# Altium project PCB_Project1.PrjPCB
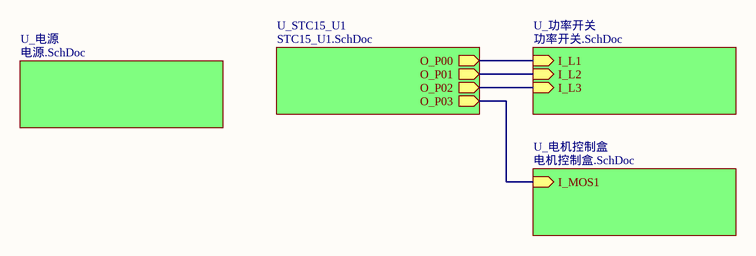
[diagram p0: 主结构图.SchDoc]
5 sheets, 93 parts. Net scope: hierarchical (ports join the sheet entries above them; power ports are global).
Board file: PCB1规则OK_铺铜.PcbDoc
Sheets:
  主结构图.SchDoc
    U_电源 = 电源.SchDoc
    U_STC15_U1 = STC15_U1.SchDoc
    U_电机控制盒 = 电机控制盒.SchDoc
    U_功率开关 = 功率开关.SchDoc

## Sheet 主结构图.SchDoc
size A4; DocumentNumber: 1; SheetNumber: 1; SheetTotal: 3

### Sub-sheets
U_STC15_U1 = STC15_U1.SchDoc: O_P00 (out), O_P01 (out), O_P02 (out), O_P03 (out)
U_功率开关 = 功率开关.SchDoc: I_L1 (in), I_L2 (in), I_L3 (in)
U_电机控制盒 = 电机控制盒.SchDoc: I_MOS1 (in)
U_电源 = 电源.SchDoc: no entries

### Nets
P0BUS0: sheet U_STC15_U1/O_P00, sheet U_功率开关/I_L1
P0BUS1: sheet U_STC15_U1/O_P01, sheet U_功率开关/I_L2
P0BUS2: sheet U_STC15_U1/O_P02, sheet U_功率开关/I_L3
P0BUS3: sheet U_STC15_U1/O_P03, sheet U_电机控制盒/I_MOS1

## Sheet 电源.SchDoc
size A4; DocumentNumber: 2; SheetNumber: 3; SheetTotal: 3
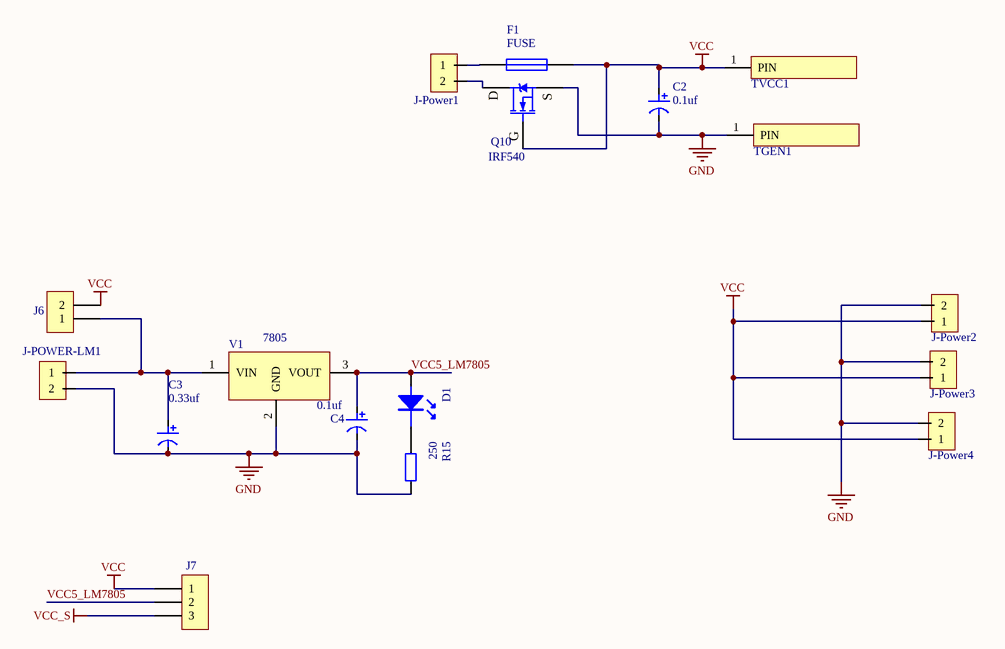
[diagram p1: 电源.SchDoc]

### Parts
C2  0.1uf  [CE5-6R5X5-1mm]
C3  0.33uf  [CE5-6R5X5-1mm]
C4  0.1uf  [CE5-6R5X5-1mm]
D1  333-2SYGD/S530-E2  [LED2-D5R9X8R7]  (value not drawn)
F1  FUSE  [FUSE-24R1X3RX29R7-TH]
J6  PAS1251-0201A01B1BA  [CON2P-2R54-TH]  (value not drawn)
J7  PAS1251-0301A01B1BA  [CON3P-2R54-TH]  (value not drawn)
J-Power1  KF301-5.08-2p  [KF301-5.0-2P]  (value not drawn)
J-Power2  KF301-5.08-2p  [KF301-5.0-2P]  (value not drawn)
J-Power3  KF301-5.08-2p  [KF301-5.0-2P]  (value not drawn)
J-Power4  KF301-5.08-2p  [KF301-5.0-2P]  (value not drawn)
J-POWER-LM1  KF301-5.08-2p  [KF301-5.0-2P]  (value not drawn)
Q10  IRF540  [TO220A]
R15  250  [RY0R25W]
TGEN1  T？  [铺铜条]  (value not drawn)
TVCC1  T？  [铺铜条]  (value not drawn)
V1  7805  [TO220A]

### Nets
GND: C2.2 C3.2 C4.2 J-Power2.2 J-Power3.2 J-Power4.2 J-POWER-LM1.2 Q10.3(S) R15.2 TGEN1.1(PIN) V1.2(GND)
VCC: C2.1 F1.2 J6.2 J7.1 J-Power2.1 J-Power3.1 J-Power4.1 Q10.1(G) TVCC1.1(PIN)
VCC_S: J7.3
VCC5_LM7805: C4.1 D1.1 J7.2 V1.3(VOUT)
NetC3_1: C3.1 J6.1 J-POWER-LM1.1 V1.1(VIN)
NetD1_2: D1.2 R15.1
NetF1_1: F1.1 J-Power1.1
NetJ-Power1_2: J-Power1.2 Q10.2(D)

### Library data of the parts
C2-C4 = 102CB-00002OD.01: DIP,电容量681pf,额定电压2000V,偏差±10%,6.5X5mm; Allow Altenative Part: Y; serial number: 14; Categories: 电容; Value: 681pF; Tolerance: ±10%; Rated Voltage: 2000V; COMPONENTLINK 1 DESCRIPTION: ShowDatasheet; Remark: Verified by BU1（黄雄青） check list V1.0; Modify time: 2015年11月05号; Approved: YES; Part Number: 102CB-00002OD.01; Category: 陶瓷电容; Operating Temperature: -25°C~105°C; PACKAGE: Bulk; Mounting Type: ThroughHole; Applications: Automotive; Size: 6.5; Max Thickness: 5; Supplier 1: TDK; Supplier Part Number 1: CK45-B3DD681KYLR; Pricing 1: 0.7242; COMPONENTLINK 1 URL: http://pdf-file.ic37.com/pdf6/TDK/CK45-B3DD222KYNA_datasheet_1118532/182787/CK45-B_datasheet.pdf; MOQ: 1000
D1 = 102DL-00010CH.01: DIP,封装/间距直径5/2.54mm,额定电压2V,亮度普亮,绿色; Allow Altenative Part: Y; serial number: 4; Categories: 二极管; Rated Voltage: 2V; COMPONENTLINK 1 DESCRIPTION: GetDatasheet; Remark: Verified by CRD（张宗良） check list V1.0; Modify time: 2015年11月11号; Approved: YES; Part Number: 102DL-00010CH.01; Category: 发光二极管; Value: 333-2SYGD/S530-E2; Other: 绿色; PACKAGE: Bulk; Mounting Type: ThroughHole; Supplier 1: 台湾亿光; Supplier Part Number 1: 333-2SYGD/S530-E2; Pricing 1: .3619; COMPONENTLINK 1 URL: http://www.everlight.com/file/ProductFile/201407052217358844.pdf; MOQ: 4000
F1 = 102FP-00037BI.01: DIP,24.1x29.7x3.0mm,额定电压30V,额定电流9A,触发电流18A,中速断; Allow Altenative Part: Y; serial number: 2; Categories: 保险丝; Value: R30-900; Rated Voltage: 30V; Rated Current: 9A; COMPONENTLINK 1 DESCRIPTION: GetDatasheet; Remark: Verified by BU1（黄雄青） check list V1.0; Modify time: 2015年07月10号; Approved: YES; Part Number: 102FP-00037BI.01; Category: 自恢复保险丝; PACKAGE: Bulk; Mounting Type: ThroughHole; Supplier 1: SEA&LAND; Supplier Part Number 1: R30-900; Pricing 1: .4; COMPONENTLINK 1 URL: http://www.littelfuse.name/te_product_d_c914/2013-10-18/7630.chtml; MOQ: 500
J6 = 102NL-00005DJ.01: DIP,封装脚距2.54mm,180度,1x2PIN,上针/下针6.0/3.0mm,黑色; Allow Altenative Part: Y; serial number: 286; Categories: 连接器; COMPONENTLINK 1 DESCRIPTION: GetDatasheet; Remark: Verified by BU2（叶俊雄） check list V1.0; Modify time: 2016年08月22号; Approved: YES; Part Number: 102NL-00005DJ.01; Category: 单排针; Value: PAS1251-0201A01B1BA; PACKAGE: Bulk; Mounting Type: ThroughHole; Supplier 1: 骏佳; Supplier Part Number 1: PAS1251-0201A01B1BA; Pricing 1: .03; COMPONENTLINK 1 URL: http://www.hkjb888.com/product.asp?action=detailed&id=1099&page=3&pid=245; MOQ: 500
J7 = 102NL-00001DJ.01: DIP,封装脚距2.54mm,180度,1x3PIN,黑色; Allow Altenative Part: Y; serial number: 168; Categories: 连接器; COMPONENTLINK 1 DESCRIPTION: GetDatasheet; Remark: Verified by CRD（赖程奇） check list V1.0; Modify time: 2016年1月11号; Approved: YES; Part Number: 102NL-00001DJ.01; Category: 单排针; Value: PAS1251-0301A01B1BA; PACKAGE: Bulk; Mounting Type: ThroughHole; Supplier 1: 骏佳; Supplier Part Number 1: PAS1251-0301A01B1BA; Pricing 1: 2.05; COMPONENTLINK 1 URL: http://www.hkjb888.com/product.asp?page=7; MOQ: 100
J-Power1-J-Power4 J-POWER-LM1 = KF301
Q10 = IRF840: N沟场效应管; 版权归属: 源创客; BOM名称: N沟场效应管; 学习资源: www.ooocke.com
R15 = 102RO-00087BS.01: DIP,阻值500R,精度±0.1%,4.75x1.65mm,额定功率1/4W; Allow Altenative Part: Y; serial number: 14; Categories: 电阻; Value: 500R; Tolerance: ±0.1%; Rated Power: 1/4W; COMPONENTLINK 1 DESCRIPTION: OpenDatasheet; Remark: Verified by BU3（吴明徽）check list V1.0; Modify time: 2015年11月30号; Approved: YES; Part Number: 102RO-00087BS.01; Category: 功率电阻; PACKAGE: Bulk; Mounting Type: ThroughHole; Size: 1.65x4.75mm; Supplier 1: Vishay; Supplier Part Number 1: CMF50500R00BKRE; Pricing 1: 1.29322; COMPONENTLINK 1 URL: http://www.vishay.com/docs/31018/cmfind.pdf; MOQ: 1000
TGEN1 TVCC1 = 铺铜条: 2mm*20的铜条用于焊接
V1 = 78xx: 线性稳压芯片; 版权归属: 源创客; BOM名称: 线性稳压芯片; 学习资源: www.ooocke.com

## Sheet STC15_U1.SchDoc
size A4; DocumentNumber: 3; SheetNumber: 2; SheetTotal: 3
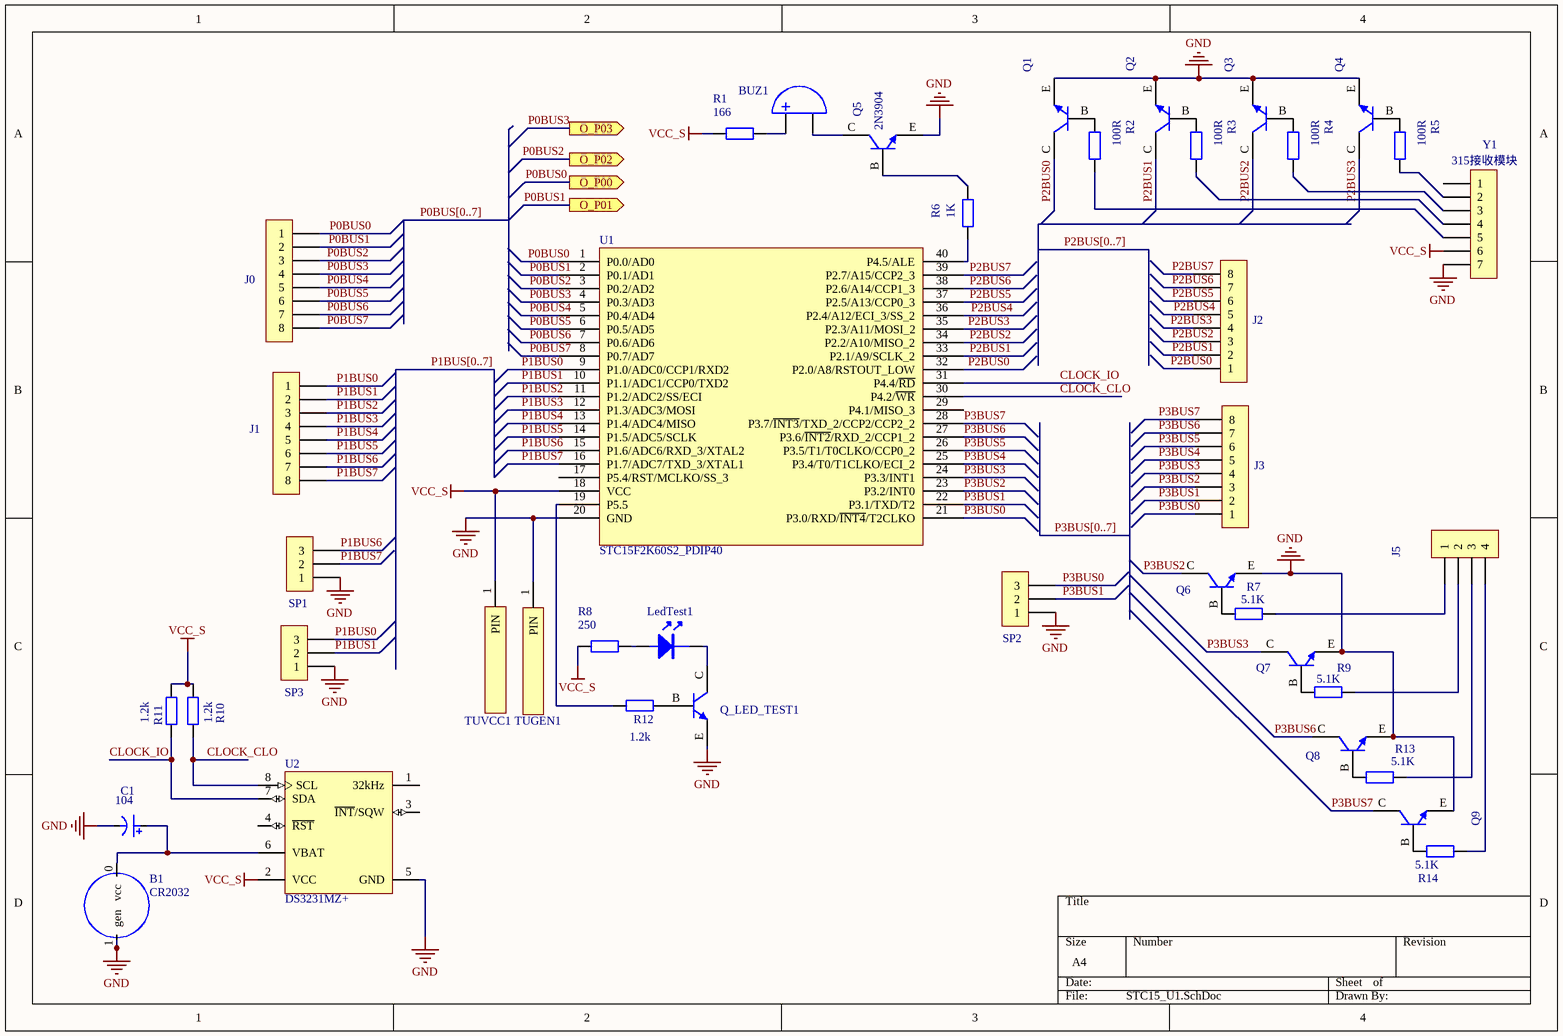
[diagram p2: STC15_U1.SchDoc]

### Parts
B1  CR2032  [CR2032座]
BUZ1  SD1209T5-A1  [BUZ5-12-0R5-9MM]  (value not drawn)
C1  104  [CE5-6R5X5-1mm]
J0  W7810811120AB  [XH8P-2R54-TH]  (value not drawn)
J1  W7810811120AB  [XH8P-2R54-TH]  (value not drawn)
J2  W7810811120AB  [XH8P-2R54-TH]  (value not drawn)
J3  W7810811120AB  [XH8P-2R54-TH]  (value not drawn)
J5  W7810411120AB  [XH4P-2R54-TH]  (value not drawn)
LedTest1  333-2SUBD/S400-A4  [LED2-D5X5]  (value not drawn)
Q1  2N3904  [TO-92-3-EBC]  (value not drawn)
Q2  2N3904  [TO-92-3-EBC]  (value not drawn)
Q3  2N3904  [TO-92-3-EBC]  (value not drawn)
Q4  2N3904  [TO-92-3-EBC]  (value not drawn)
Q5  2N3904  [TO-92-3-EBC]
Q6  2N3904  [TO-92-3-EBC]  (value not drawn)
Q7  2N3904  [TO-92-3-EBC]  (value not drawn)
Q8  2N3904  [TO-92-3-EBC]  (value not drawn)
Q9  2N3904  [TO-92-3-EBC]  (value not drawn)
Q_LED_TEST1  2N3904  [TO-92-3-EBC]  (value not drawn)
R1  166  [RY0R25W]
R2  100R  [RY0R25W]
R3  100R  [RY0R25W]
R4  100R  [RY0R25W]
R5  100R  [RY0R25W]
R6  1K  [RY0R25W]
R7  5.1K  [RY0R25W]
R8  250  [RY0R25W]
R9  5.1K  [RY0R25W]
R10  1.2k  [RY0R25W]
R11  1.2k  [RY0R25W]
R12  1.2k  [RY0R25W]
R13  5.1K  [RY0R25W]
R14  5.1K  [RY0R25W]
SP1  (no value)  [XH3P-2R54-TH]
SP2  (no value)  [XH3P-2R54-TH]
SP3  (no value)  [XH3P-2R54-TH]
TUGEN1  T？  [铺铜条]  (value not drawn)
TUVCC1  T？  [铺铜条]  (value not drawn)
U1  STC15F2K60S2_PDIP40  [DIP40]
U2  DS3231MZ+  [S8MK+1_L]
Y1  315接收模块  [CON7P-2R54-TH]

### Ports
O_P00 (out), O_P01 (out), O_P02 (out), O_P03 (out)

### Nets
GND: B1.1(gen) C1.2 Q1.E Q2.E Q3.E Q4.E Q5.E Q6.E Q7.E Q8.E Q9.E Q_LED_TEST1.E SP1.1 SP2.1 SP3.1 TUGEN1.1(PIN) U1.20(GND) U2.5(GND) Y1.7
VCC_S: R1.1 R8.1 R10.1 R11.1 TUVCC1.1(PIN) U1.18(VCC) U2.2(VCC) Y1.6
CLOCK_CLO: R10.2 U1.30(P4.2/~{WR}) U2.8(SCL)
CLOCK_IO: R11.2 U1.31(P4.4/~{RD}) U2.7(SDA)
P0BUS0: J0.1 U1.1(P0.0/AD0) ; port O_P00
P0BUS1: J0.2 U1.2(P0.1/AD1) ; port O_P01
P0BUS2: J0.3 U1.3(P0.2/AD2) ; port O_P02
P0BUS3: J0.4 U1.4(P0.3/AD3) ; port O_P03
P0BUS4: J0.5 U1.5(P0.4/AD4)
P0BUS5: J0.6 U1.6(P0.5/AD5)
P0BUS6: J0.7 U1.7(P0.6/AD6)
P0BUS7: J0.8 U1.8(P0.7/AD7)
P1BUS0: J1.1 SP3.3 U1.9(P1.0/ADC0/CCP1/RXD2)
P1BUS1: J1.2 SP3.2 U1.10(P1.1/ADC1/CCP0/TXD2)
P1BUS2: J1.3 U1.11(P1.2/ADC2/SS/ECI)
P1BUS3: J1.4 U1.12(P1.3/ADC3/MOSI)
P1BUS4: J1.5 U1.13(P1.4/ADC4/MISO)
P1BUS5: J1.6 U1.14(P1.5/ADC5/SCLK)
P1BUS6: J1.7 SP1.3 U1.15(P1.6/ADC6/RXD_3/XTAL2)
P1BUS7: J1.8 SP1.2 U1.16(P1.7/ADC7/TXD_3/XTAL1)
P2BUS0: J2.1 Q1.C U1.32(P2.0/A8/RSTOUT_LOW)
P2BUS1: J2.2 Q2.C U1.33(P2.1/A9/SCLK_2)
P2BUS2: J2.3 Q3.C U1.34(P2.2/A10/MISO_2)
P2BUS3: J2.4 Q4.C U1.35(P2.3/A11/MOSI_2)
P2BUS4: J2.5 U1.36(P2.4/A12/ECI_3/SS_2)
P2BUS5: J2.6 U1.37(P2.5/A13/CCP0_3)
P2BUS6: J2.7 U1.38(P2.6/A14/CCP1_3)
P2BUS7: J2.8 U1.39(P2.7/A15/CCP2_3)
P3BUS0: J3.1 SP2.3 U1.21(P3.0/RXD/~{INT4}/T2CLKO)
P3BUS1: J3.2 SP2.2 U1.22(P3.1/TXD/T2)
P3BUS2: J3.3 Q6.C U1.23(P3.2/INT0)
P3BUS3: J3.4 Q7.C U1.24(P3.3/INT1)
P3BUS4: J3.5 U1.25(P3.4/T0/T1CLKO/ECI_2)
P3BUS5: J3.6 U1.26(P3.5/T1/T0CLKO/CCP0_2)
P3BUS6: J3.7 Q8.C U1.27(P3.6/~{INT2}/RXD_2/CCP1_2)
P3BUS7: J3.8 Q9.C U1.28(P3.7/~{INT3}/TXD_2/CCP2/CCP2_2)
NetB1_0: B1.0(vcc) C1.1 U2.6(VBAT)
NetBUZ1_1: BUZ1.1 R1.2
NetBUZ1_2: BUZ1.2 Q5.C
NetJ5_1: J5.1 R7.2
NetJ5_2: J5.2 R9.2
NetJ5_3: J5.3 R13.2
NetJ5_4: J5.4 R14.2
NetLedTest1_1: LedTest1.1 R8.2
NetLedTest1_2: LedTest1.2 Q_LED_TEST1.C
NetQ1_B: Q1.B R2.1
NetQ2_B: Q2.B R3.1
NetQ3_B: Q3.B R4.1
NetQ4_B: Q4.B R5.1
NetQ5_B: Q5.B R6.2
NetQ6_B: Q6.B R7.1
NetQ7_B: Q7.B R9.1
NetQ8_B: Q8.B R13.1
NetQ9_B: Q9.B R14.1
NetQ_LED_TEST1_B: Q_LED_TEST1.B R12.2
NetR2_2: R2.2 Y1.5
NetR3_2: R3.2 Y1.4
NetR4_2: R4.2 Y1.3
NetR5_2: R5.2 Y1.2
NetR6_1: R6.1 U1.40(P4.5/ALE)
NetR12_1: R12.1 U1.19(P5.5)

Not connected (* = marked no-connect by the designer): U1 17(P5.4/RST/MCLKO/SS_3) 29(P4.1/MISO_3); U2 1(32kHz) 3(~{INT}/SQW) 4(~{RST}); Y1 1

### Buses and harness runs
bus P0BUS[0..7]
bus P1BUS[0..7]
bus P2BUS[0..7]
bus P3BUS[0..7]

### Library data of the parts
BUZ1 = 102BA-00004OD.01: DIP,12x9mm,额定电压DC5V,频率2048Hz,黑色,间距5mm; Allow Altenative Part: Y; serial number: 4; Categories: 蜂鸣器; COMPONENTLINK 1 DESCRIPTION: GetDatasheet; Remark: Verified by BU1（黄雄青） check list V1.0; Modify time: 2016年05月12号; Approved: YES; Part Number: 102BA-00004OD.01; Category: 有源蜂鸣器; Value: SD1209T5-A1; PACKAGE: tray; Mounting Type: ThroughHole; Size: 12x9mm; Supplier 1: TDK; Supplier Part Number 1: SD1209T5-A1; Pricing 1: 6.73; COMPONENTLINK 1 URL: https://product.tdk.com/info/en/catalog/datasheets/ec211_sd.pdf; MOQ: 5000
C1 = 102CB-00002OD.01: as C2 on sheet 电源; Part Number: 102CB-00002OD.01; Category: 陶瓷电容; Operating Temperature: -25°C~105°C; PACKAGE: Bulk; Mounting Type: ThroughHole; Applications: Automotive; Size: 6.5; Max Thickness: 5; Supplier 1: TDK; Supplier Part Number 1: CK45-B3DD681KYLR; Pricing 1: 0.7242; COMPONENTLINK 1 URL: http://pdf-file.ic37.com/pdf6/TDK/CK45-B3DD222KYNA_datasheet_1118532/182787/CK45-B_datasheet.pdf; MOQ: 1000
J0-J3 = 102NB-00026CY.01: DIP,座子,封装脚距2.54mm,180度,1x8PIN,塑高/针长7.0/3.40mm,白色; Allow Altenative Part: Y; serial number: 280; Categories: 连接器; COMPONENTLINK 1 DESCRIPTION: GetDatasheet; Remark: Verified by CRD（赖程奇） check list V1.0; Modify time: 2016年08月22号; Approved: YES; Part Number: 102NB-00026CY.01; Category: XH连接器; Value: W7810811120AB; PACKAGE: Bulk; Mounting Type: ThroughHole; Supplier 1: 富盈源; Supplier Part Number 1: W7810811120AB; Pricing 1: .03; COMPONENTLINK 1 URL: http://www.fyconn.com/productView.asp?id=445; MOQ: 500
J5 = 102NB-00025CY.01: DIP,座子,封装脚距2.54mm,180度,1x4PIN,塑高/针长7.0/3.40mm,白色; Allow Altenative Part: Y; serial number: 276; Categories: 连接器; COMPONENTLINK 1 DESCRIPTION: GetDatasheet; Remark: Verified by CRD（赖程奇） check list V1.0; Modify time: 2016年05月12号; Approved: YES; Part Number: 102NB-00025CY.01; Category: XH连接器; Value: W7810411120AB; PACKAGE: Bulk; Mounting Type: ThroughHole; Supplier 1: 富盈源; Supplier Part Number 1: W7810411120AB; Pricing 1: 3.8; COMPONENTLINK 1 URL: http://www.fyconn.com/productView.asp?id=340; MOQ: 500
LedTest1 = 102DL-00029CH.01: DIP,封装/间距直径5/2.54mm,额定电压3.3V,亮度高亮,蓝色; Allow Altenative Part: Y; serial number: 36; Categories: 二极管; Rated Voltage: 3.3V; COMPONENTLINK 1 DESCRIPTION: OpenDatasheet; Remark: Verified by CRD（张宗良） check list V1.0; Modify time: 2017年01月07号; Approved: YES; Part Number: 102DL-00029CH.01; Category: 发光二极管; Value: 333-2SUBD/S400-A4; Other: 蓝色; PACKAGE: Bulk; Mounting Type: ThroughHole; Supplier 1: 台湾亿光; Supplier Part Number 1: 333-2SUBD/S400-A4; COMPONENTLINK 1 URL: http://www.everlight.com/file/ProductFile/333-2SUBD-S400-A4.pdf
Q1-Q9 Q_LED_TEST1 = 102GN-00009BA.01: DIP,封装形式TO-92-3,耐压值40V,额定电流200mA,耗散功率625mW; Allow Altenative Part: Y; serial number: 1; Categories: 三极管; Rated Power: 625mW; Rated Voltage: 40V; Rated Current: 0.2A; COMPONENTLINK 1 DESCRIPTION: OpenDatasheet; Remark: Verified by BU1（吴明徽）check list V1.0; Modify time: 2015年08月08号; Approved: YES; Part Number: 102GN-00009BA.01; Category: NPN三极管; Value: 2N3904; PACKAGE: Tape&Reel; Mounting Type: SurfaceMount; Size: TO-92-3; Supplier 1: ON; Supplier Part Number 1: 2N3904; Pricing 1: .17; COMPONENTLINK 1 URL: http://media.digikey.com/pdf/Data%20Sheets/ON%20Semiconductor%20PDFs/2N3903,%202N3904%20Rev4.pdf; MOQ: 1000
R1 = 102RO-00079BW.01: DIP,阻值1K,精度±5%,9.0x3.3mm,额定功率1/2W; Allow Altenative Part: Y; serial number: 13; Categories: 电阻; Value: 1K; Tolerance: ±5%; Rated Power: 1/2W; COMPONENTLINK 1 DESCRIPTION: OpenDatasheet; Remark: Verified by BU3（吴明徽）check list V1.0; Modify time: 2015年07月10号; Approved: YES; Part Number: 102RO-00079BW.01; Category: 功率电阻; PACKAGE: Bulk; Mounting Type: ThroughHole; Size: 9.0x3.3mm; Supplier 1: YAGEO; Supplier Part Number 1: CFR-50JB-52-1K; Pricing 1: .155; COMPONENTLINK 1 URL: http://www.yageo.com/documents/recent/Yageo%20LR_CFR_2013.pdf; MOQ: 500
R2-R5 = 102RO-00040BS.01: DIP,阻值100R,精度±1%,6.1x2.29mm,额定功率1/4W; Allow Altenative Part: Y; serial number: 15; Categories: 电阻; Tolerance: ±1%; Rated Power: 1/4W; COMPONENTLINK 1 DESCRIPTION: OpenDatasheet; Remark: Verified by BU3（吴明徽）check list V1.0; Modify time: 2015年07月10号; Approved: YES; Part Number: 102RO-00040BS.01; Category: 功率电阻; Value: 100R; PACKAGE: Bulk; Mounting Type: ThroughHole; Size: 2.29x7.37mm; Supplier 1: Vishay; Supplier Part Number 1: CMF55100R00FKRE39; Pricing 1: 1.44; COMPONENTLINK 1 URL: http://www.vishay.com/docs/31027/cmfmil.pdf; MOQ: 5000
R6 = 102RO-00079BW.01: DIP,阻值1K,精度±5%,9.0x3.3mm,额定功率1/2W; Allow Altenative Part: Y; serial number: 13; Categories: 电阻; Tolerance: ±5%; Rated Power: 1/2W; COMPONENTLINK 1 DESCRIPTION: OpenDatasheet; Remark: Verified by BU3（吴明徽）check list V1.0; Modify time: 2015年07月10号; Approved: YES; Part Number: 102RO-00079BW.01; Category: 功率电阻; Value: 1K; PACKAGE: Bulk; Mounting Type: ThroughHole; Size: 9.0x3.3mm; Supplier 1: YAGEO; Supplier Part Number 1: CFR-50JB-52-1K; Pricing 1: .155; COMPONENTLINK 1 URL: http://www.yageo.com/documents/recent/Yageo%20LR_CFR_2013.pdf; MOQ: 500
R7 R9 R13 R14 = 102RO-00048BS.01: DIP,阻值5.1K,精度±1%,6.2x2.29mm,额定功率1/4W; Allow Altenative Part: Y; serial number: 10; Categories: 电阻; Tolerance: ±1%; Rated Power: 1/4W; COMPONENTLINK 1 DESCRIPTION: OpenDatasheet; Remark: Verified by BU3（吴明徽）check list V1.0; Modify time: 2015年07月10号; Approved: YES; Part Number: 102RO-00048BS.01; Category: 功率电阻; Value: 5.1K; PACKAGE: Bulk; Mounting Type: ThroughHole; Size: 2.29x7.5mm; Supplier 1: Vishay; Supplier Part Number 1: CCF555K10FKE36; Pricing 1: 4.48; COMPONENTLINK 1 URL: http://www.vishay.com/docs/31015/ccf55.pdf; MOQ: 5000
R8 R10-R12 = 102RO-00036BS.01: DIP,阻值8.2R,精度±1%,AXIAL0.4,额定功率1/2W; Allow Altenative Part: Y; serial number: 11; Categories: 电阻; Value: 8.2R; Tolerance: ±1%; Rated Power: 1/2W; COMPONENTLINK 1 DESCRIPTION: OpenDatasheet; Remark: Verified by BU3（吴明徽）check list V1.0; Modify time: 2015年07月10号; Approved: YES; Part Number: 102RO-00036BS.01; Category: 功率电阻; PACKAGE: Bulk; Mounting Type: ThroughHole; Size: 2.29x7.5mm; Supplier 1: Vishay; Supplier Part Number 1: CCF558R20FKE36; Pricing 1: 4.48; COMPONENTLINK 1 URL: http://www.vishay.com/docs/31015/ccf55.pdf; MOQ: 5000
SP1-SP3 = 102NB-00017CY.01: DIP,座子,封装脚距2.54mm,180度,1x3PIN,塑高/针长7.0/3.40mm,白色; Allow Altenative Part: Y; serial number: 68; Categories: 连接器; COMPONENTLINK 1 DESCRIPTION: GetDatasheet; Remark: Verified by CRD（赖程奇） check list V1.0; Modify time: 2015年11月06号; Approved: YES; Part Number: 102NB-00017CY.01; Category: XH连接器; PACKAGE: Bulk; Mounting Type: ThroughHole; Supplier 1: 富盈源; Supplier Part Number 1: W7810311120AB; Pricing 1: .35; COMPONENTLINK 1 URL: http://www.fyconn.com/productView.asp?id=445; MOQ: 500
TUGEN1 TUVCC1 = 铺铜条: 2mm*20的铜条用于焊接
U2 = DS3231MZ+: +/-5ppm, MEMS based Real-Time Clock, I2C Interface, 8-Pin SO, -40 to 85 degC, Pb-Free; DatasheetVersion: Rev 3, Dec-2011; PackageVersion: revC, 2010; PackageReference: S8MK+1; PackageDescription: 8-Pin Small-Outline IC, Narrow (0.15in), 1.27 mm Pitch, SOIC (N), Pb-Free; Code_JEDEC: MS-012-AA; Code_IPC: SOIC127P600-8; ComponentLink1Description: Manufacturer URL; ComponentLink1URL: http://www.maxim-ic.com; ComponentLink2Description: Datasheet; ComponentLink2URL: http://datasheets.maxim-ic.com/en/ds/DS3231M.pdf; ComponentLink3Description: Package Specification; ComponentLink3URL: http://pdfserv.maxim-ic.com/package_dwgs/21-0041.PDF
Y1 = 102NL-00032BV.01: DIP,封装脚距2.54mm,180度,1x7PIN,黑色; Allow Altenative Part: Y; serial number: 165; Categories: 连接器; Value: 61300711121; COMPONENTLINK 1 DESCRIPTION: GetDatasheet; Remark: Verified by CRD（赖程奇） check list V1.0; Modify time: 2015年07月10号; Approved: YES; Part Number: 102NL-00032BV.01; Category: 单排针; PACKAGE: Bulk; Mounting Type: ThroughHole; Supplier 1: wurth; Supplier Part Number 1: 61300711121; Pricing 1: 2.05; COMPONENTLINK 1 URL: http://katalog.we-online.de/en/em/620_0xx_111_21/620_032_111_21?m=n&sp=http%3A%2F%2Fwww.we-online.com%2Fweb%2Fen%2Fwuerth_elektronik%2Fsearchpage.php%3Fsearch%3D62003211121; MOQ: 500

## Sheet 电机控制盒.SchDoc
size A4; SheetNumber: 4
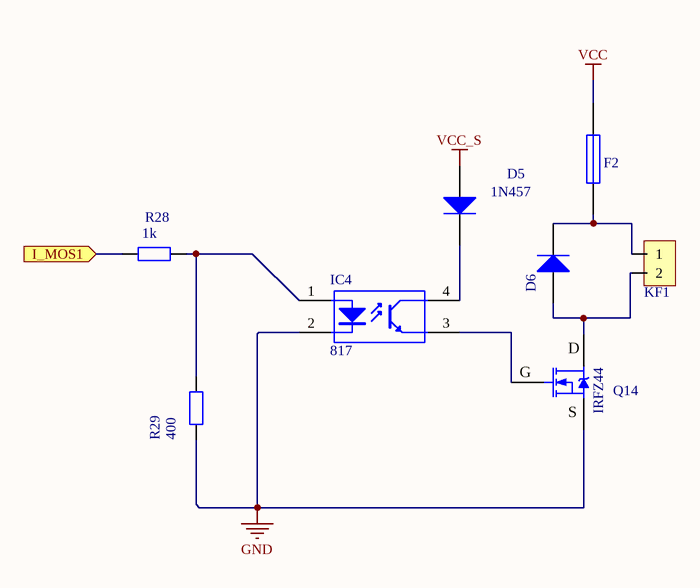
[diagram p3: 电机控制盒.SchDoc]

### Parts
D5  1N457  [DO-35]
D6  1N4007-E3/73  [DO-41]  (value not drawn)
F2  R30-600  [FUSE-16R5X3RX24R9-TH]  (value not drawn)
IC4  817  [DIP4-300]
KF1  KF301-5.08-2p  [KF301-5.0-2P]  (value not drawn)
Q14  IRFZ44  [TO220A]
R28  1k  [RY0R25W]
R29  400  [RY0R25W]

### Ports
I_MOS1 (in)

### Nets
GND: IC4.2(K) Q14.3(S) R29.1
VCC: F2.2
VCC_S: D5.1
P0BUS3: R28.1 ; port I_MOS1
NetD5_2: D5.2 IC4.4(C)
NetD6_1: D6.1 KF1.2 Q14.2(D)
NetD6_2: D6.2 F2.1 KF1.1
NetIC4_1: IC4.1(A) R28.2 R29.2
NetIC4_3: IC4.3(E) Q14.1(G)

### Library data of the parts
D5 = 102DG-00002AI.01: DIP,D0-35,额定电压70V,电流200mA; Allow Altenative Part: Y; serial number: 8; Categories: 二极管; Rated Voltage: 70V; Rated Current: 200mA; COMPONENTLINK 1 DESCRIPTION: GetDatasheet; Remark: Verified by CRD（张宗良） check list V1.0; Modify time: 2015年07月10号; Approved: YES; Part Number: 102DG-00002AI.01; Category: 普通二极管; Value: 1N457; PACKAGE: Bulk; Mounting Type: ThroughHole; Supplier 1: FAIRCHILD; Supplier Part Number 1: 1N457; Pricing 1: .174; COMPONENTLINK 1 URL: https://www.fairchildsemi.com/datasheets/1N/1N457.pdf; MOQ: 10000
D6 = 102DG-00002BS.01: DIP,DO-41,额定电压1000V,电流1A; Allow Altenative Part: Y; serial number: 32; Categories: 二极管; Rated Voltage: 1000V; Rated Current: 1A; COMPONENTLINK 1 DESCRIPTION: OpenDatasheet; Remark: Verified by CRD（张宗良） check list V1.0; Modify time: 2016年08月22号; Approved: YES; Part Number: 102DG-00002BS.01; Category: 普通二极管; Value: 1N4007-E3/73; PACKAGE: Bulk; Mounting Type: ThroughHole; Supplier 1: Vishay; Supplier Part Number 1: 1N4007-E3/73; Pricing 1: .33; COMPONENTLINK 1 URL: http://www.vishay.com/docs/88503/1n4001.pdf; MOQ: 3000
F2 = 102FP-00034BI.01: DIP,16.5x24.9x3.0mm,额定电压30V,额定电流6A,触发电流12A,中速断; Allow Altenative Part: Y; serial number: 3; Categories: 保险丝; Rated Voltage: 30V; Rated Current: 6A; COMPONENTLINK 1 DESCRIPTION: GetDatasheet; Remark: Verified by BU1（黄雄青） check list V1.0; Modify time: 2015年07月10号; Approved: YES; Part Number: 102FP-00034BI.01; Category: 自恢复保险丝; Value: R30-600; PACKAGE: Bulk; Mounting Type: ThroughHole; Supplier 1: SEA&LAND; Supplier Part Number 1: R30-600; Pricing 1: .4; COMPONENTLINK 1 URL: http://www.littelfuse.name/te_product_d_c914/2013-10-18/7630.chtml; MOQ: 500
IC4 = 817: 线性光耦; 版权归属: 源创客; BOM名称: 线性光耦; 学习资源: www.ooocke.com
KF1 = KF301
Q14 = IRF840: N沟场效应管; 版权归属: 源创客; BOM名称: N沟场效应管; 学习资源: www.ooocke.com
R28 R29 = 102RO-00018BW.01: DIP,阻值1M,精度±1%,AXIAL0.4,额定功率1/4W; Allow Altenative Part: Y; serial number: 39; Categories: 电阻; Value: 1M; Tolerance: ±1%; Rated Power: 1/4W; COMPONENTLINK 1 DESCRIPTION: OpenDatasheet; Remark: Verified by BU3（吴明徽）check list V1.0; Modify time: 2015年11月30号; Approved: YES; Part Number: 102RO-00018BW.01; Category: 功率电阻; PACKAGE: Bulk; Mounting Type: ThroughHole; Size: 2.4x6.3mm; Supplier 1: YAGEO; Supplier Part Number 1: MFR-25FTF26-1M; Pricing 1: .08; COMPONENTLINK 1 URL: http://www.yageo.com/documents/recent/Yageo%20LR_MFR_2013.pdf; MOQ: 5000

## Sheet 功率开关.SchDoc
size A4
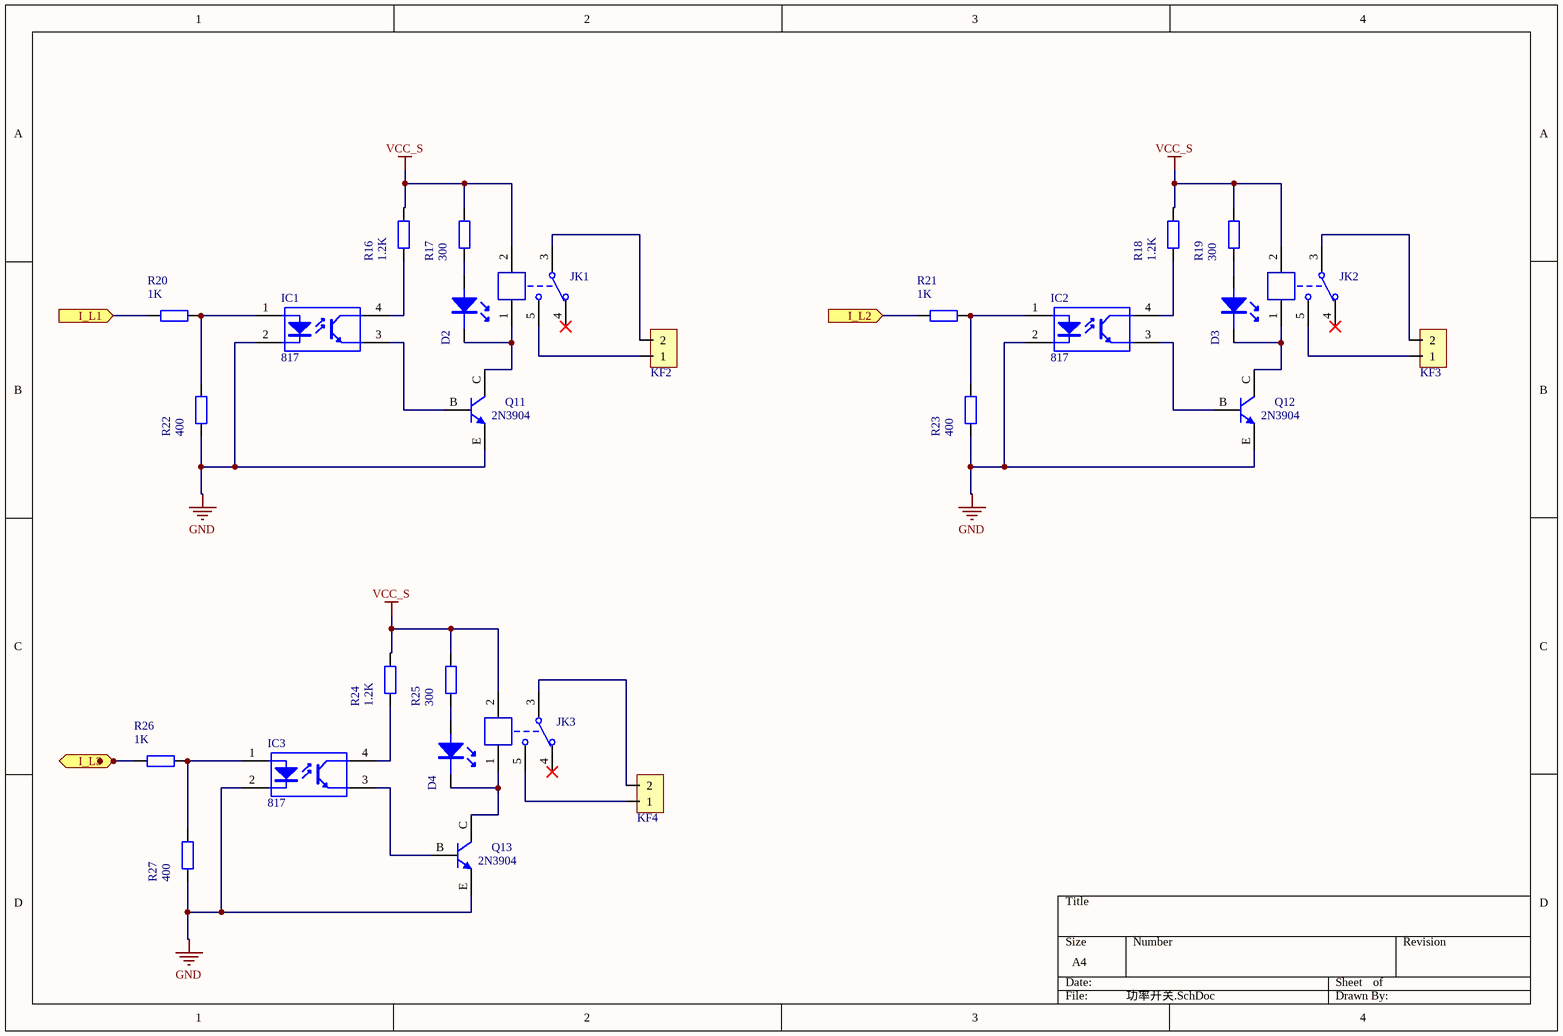
[diagram p4: 功率开关.SchDoc]

### Parts
D2  C535A WJN CU0V0231  [LED2-D5X5]  (value not drawn)
D3  C535A WJN CU0V0231  [LED2-D5X5]  (value not drawn)
D4  C535A WJN CU0V0231  [LED2-D5X5]  (value not drawn)
IC1  817  [DIP4-300]
IC2  817  [DIP4-300]
IC3  817  [DIP4-300]
JK1  SRD-05VDC-SL-C  [SRD-C_B]  (value not drawn)
JK2  SRD-05VDC-SL-C  [SRD-C_B]  (value not drawn)
JK3  SRD-05VDC-SL-C  [SRD-C_B]  (value not drawn)
KF2  KF301-5.08-2p  [KF301-5.0-2P]  (value not drawn)
KF3  KF301-5.08-2p  [KF301-5.0-2P]  (value not drawn)
KF4  KF301-5.08-2p  [KF301-5.0-2P]  (value not drawn)
Q11  2N3904  [TO-92-3-EBC]
Q12  2N3904  [TO-92-3-EBC]
Q13  2N3904  [TO-92-3-EBC]
R16  1.2K  [RY0R25W]
R17  300  [RY0R25W]
R18  1.2K  [RY0R25W]
R19  300  [RY0R25W]
R20  1K  [RY0R25W]
R21  1K  [RY0R25W]
R22  400  [RY0R25W]
R23  400  [RY0R25W]
R24  1.2K  [RY0R25W]
R25  300  [RY0R25W]
R26  1K  [RY0R25W]
R27  400  [RY0R25W]

### Ports
I_L1 (in), I_L2 (in), I_L3 (in)

### Nets
GND: IC1.2(K) IC2.2(K) IC3.2(K) Q11.E Q12.E Q13.E R22.1 R23.1 R27.1
VCC_S: JK1.2 JK2.2 JK3.2 R16.2 R17.2 R18.2 R19.2 R24.2 R25.2
P0BUS0: R20.1 ; port I_L1
P0BUS1: R21.1 ; port I_L2
P0BUS2: R26.1 ; port I_L3
NetD2_1: D2.1 R17.1
NetD2_2: D2.2 JK1.1 Q11.C
NetD3_1: D3.1 R19.1
NetD3_2: D3.2 JK2.1 Q12.C
NetD4_1: D4.1 R25.1
NetD4_2: D4.2 JK3.1 Q13.C
NetIC1_1: IC1.1(A) R20.2 R22.2
NetIC1_3: IC1.3(E) Q11.B
NetIC1_4: IC1.4(C) R16.1
NetIC2_1: IC2.1(A) R21.2 R23.2
NetIC2_3: IC2.3(E) Q12.B
NetIC2_4: IC2.4(C) R18.1
NetIC3_1: IC3.1(A) R26.2 R27.2
NetIC3_3: IC3.3(E) Q13.B
NetIC3_4: IC3.4(C) R24.1
NetJK1_3: JK1.3 KF2.2
NetJK1_5: JK1.5 KF2.1
NetJK2_3: JK2.3 KF3.2
NetJK2_5: JK2.5 KF3.1
NetJK3_3: JK3.3 KF4.2
NetJK3_5: JK3.5 KF4.1

Not connected (* = marked no-connect by the designer): JK1 4*; JK2 4*; JK3 4*

### Library data of the parts
D2-D4 = 102DL-00002DG.01: DIP,封装/间距直径5/2.54mm,额定电压3.2V,亮度高亮,白色; Allow Altenative Part: Y; serial number: 34; Categories: 二极管; Rated Voltage: 3.2V; COMPONENTLINK 1 DESCRIPTION: OpenDatasheet; Remark: Verified by CRD（张宗良） check list V1.0; Modify time: 2017年01月07号; Approved: YES; Part Number: 102DL-00002DG.01; Category: 发光二极管; Value: C535A WJN CU0V0231; Other: 白色; PACKAGE: Bulk; Mounting Type: ThroughHole; Supplier 1: CREE; Supplier Part Number 1: C535A WJN CU0V0231; COMPONENTLINK 1 URL: http://www.cree.com/~/media/Files/Cree/LED-Components-and-Modules/HB/Data-Sheets/C535A-WJN-877.pdf
IC1-IC3 = 817: 线性光耦; 版权归属: 源创客; BOM名称: 线性光耦; 学习资源: www.ooocke.com
JK1-JK3 = SRD-05VDC-SL-C: 5V一组转换; BOM名称: 5V继电器; 版权归属: 源创客; 学习资源: www.ooocke.com
KF2-KF4 = KF301
Q11-Q13 = 102GN-00009BA.01: as Q1 on sheet STC15_U1; Part Number: 102GN-00009BA.01; Category: NPN三极管; Value: 2N3904; PACKAGE: Tape&Reel; Mounting Type: SurfaceMount; Size: TO-92-3; Supplier 1: ON; Supplier Part Number 1: 2N3904; Pricing 1: .17; COMPONENTLINK 1 URL: http://media.digikey.com/pdf/Data%20Sheets/ON%20Semiconductor%20PDFs/2N3903,%202N3904%20Rev4.pdf; MOQ: 1000
R16-R19 R22-R25 R27 = 102RO-00085BW.01: DIP,阻值1K,精度±0.1%,AXIAL0.4,额定功率1/4W; Allow Altenative Part: Y; serial number: 38; Categories: 电阻; Value: 1K; Tolerance: ±1%; Rated Power: 1/4W; COMPONENTLINK 1 DESCRIPTION: OpenDatasheet; Remark: Verified by BU3（吴明徽）check list V1.0; Modify time: 2015年11月30号; Approved: YES; Part Number: 102RO-00085BW.01; Category: 功率电阻; PACKAGE: Bulk; Mounting Type: ThroughHole; Size: 2.4x6.3mm; Supplier 1: YAGEO; Supplier Part Number 1: MFR-25FTF26-1K; Pricing 1: .08; COMPONENTLINK 1 URL: http://www.yageo.com/NewPortal/_cn/search/search-2.jsp; MOQ: 5000
R20 R21 R26 = 102RO-00085BW.01: DIP,阻值1K,精度±0.1%,AXIAL0.4,额定功率1/4W; Allow Altenative Part: Y; serial number: 38; Categories: 电阻; Tolerance: ±1%; Rated Power: 1/4W; COMPONENTLINK 1 DESCRIPTION: OpenDatasheet; Remark: Verified by BU3（吴明徽）check list V1.0; Modify time: 2015年11月30号; Approved: YES; Part Number: 102RO-00085BW.01; Category: 功率电阻; Value: 1K; PACKAGE: Bulk; Mounting Type: ThroughHole; Size: 2.4x6.3mm; Supplier 1: YAGEO; Supplier Part Number 1: MFR-25FTF26-1K; Pricing 1: .08; COMPONENTLINK 1 URL: http://www.yageo.com/NewPortal/_cn/search/search-2.jsp; MOQ: 5000

## Nets that join several sheets
GND: 电源 (11 pins), STC15_U1 (19 pins), 电机控制盒 (IC4.2 Q14.3 R29.1), 功率开关 (9 pins)
VCC: 电源 (9 pins), 电机控制盒 (F2.2)
VCC_S: 电源 (J7.3), STC15_U1 (8 pins), 电机控制盒 (D5.1), 功率开关 (9 pins)
P0BUS0: STC15_U1 (J0.1 U1.1), 功率开关 (R20.1)
P0BUS1: STC15_U1 (J0.2 U1.2), 功率开关 (R21.1)
P0BUS2: STC15_U1 (J0.3 U1.3), 功率开关 (R26.1)
P0BUS3: STC15_U1 (J0.4 U1.4), 电机控制盒 (R28.1)